# EAGLE design rfm69_32u4_pa (EAGLE 8.3.1)
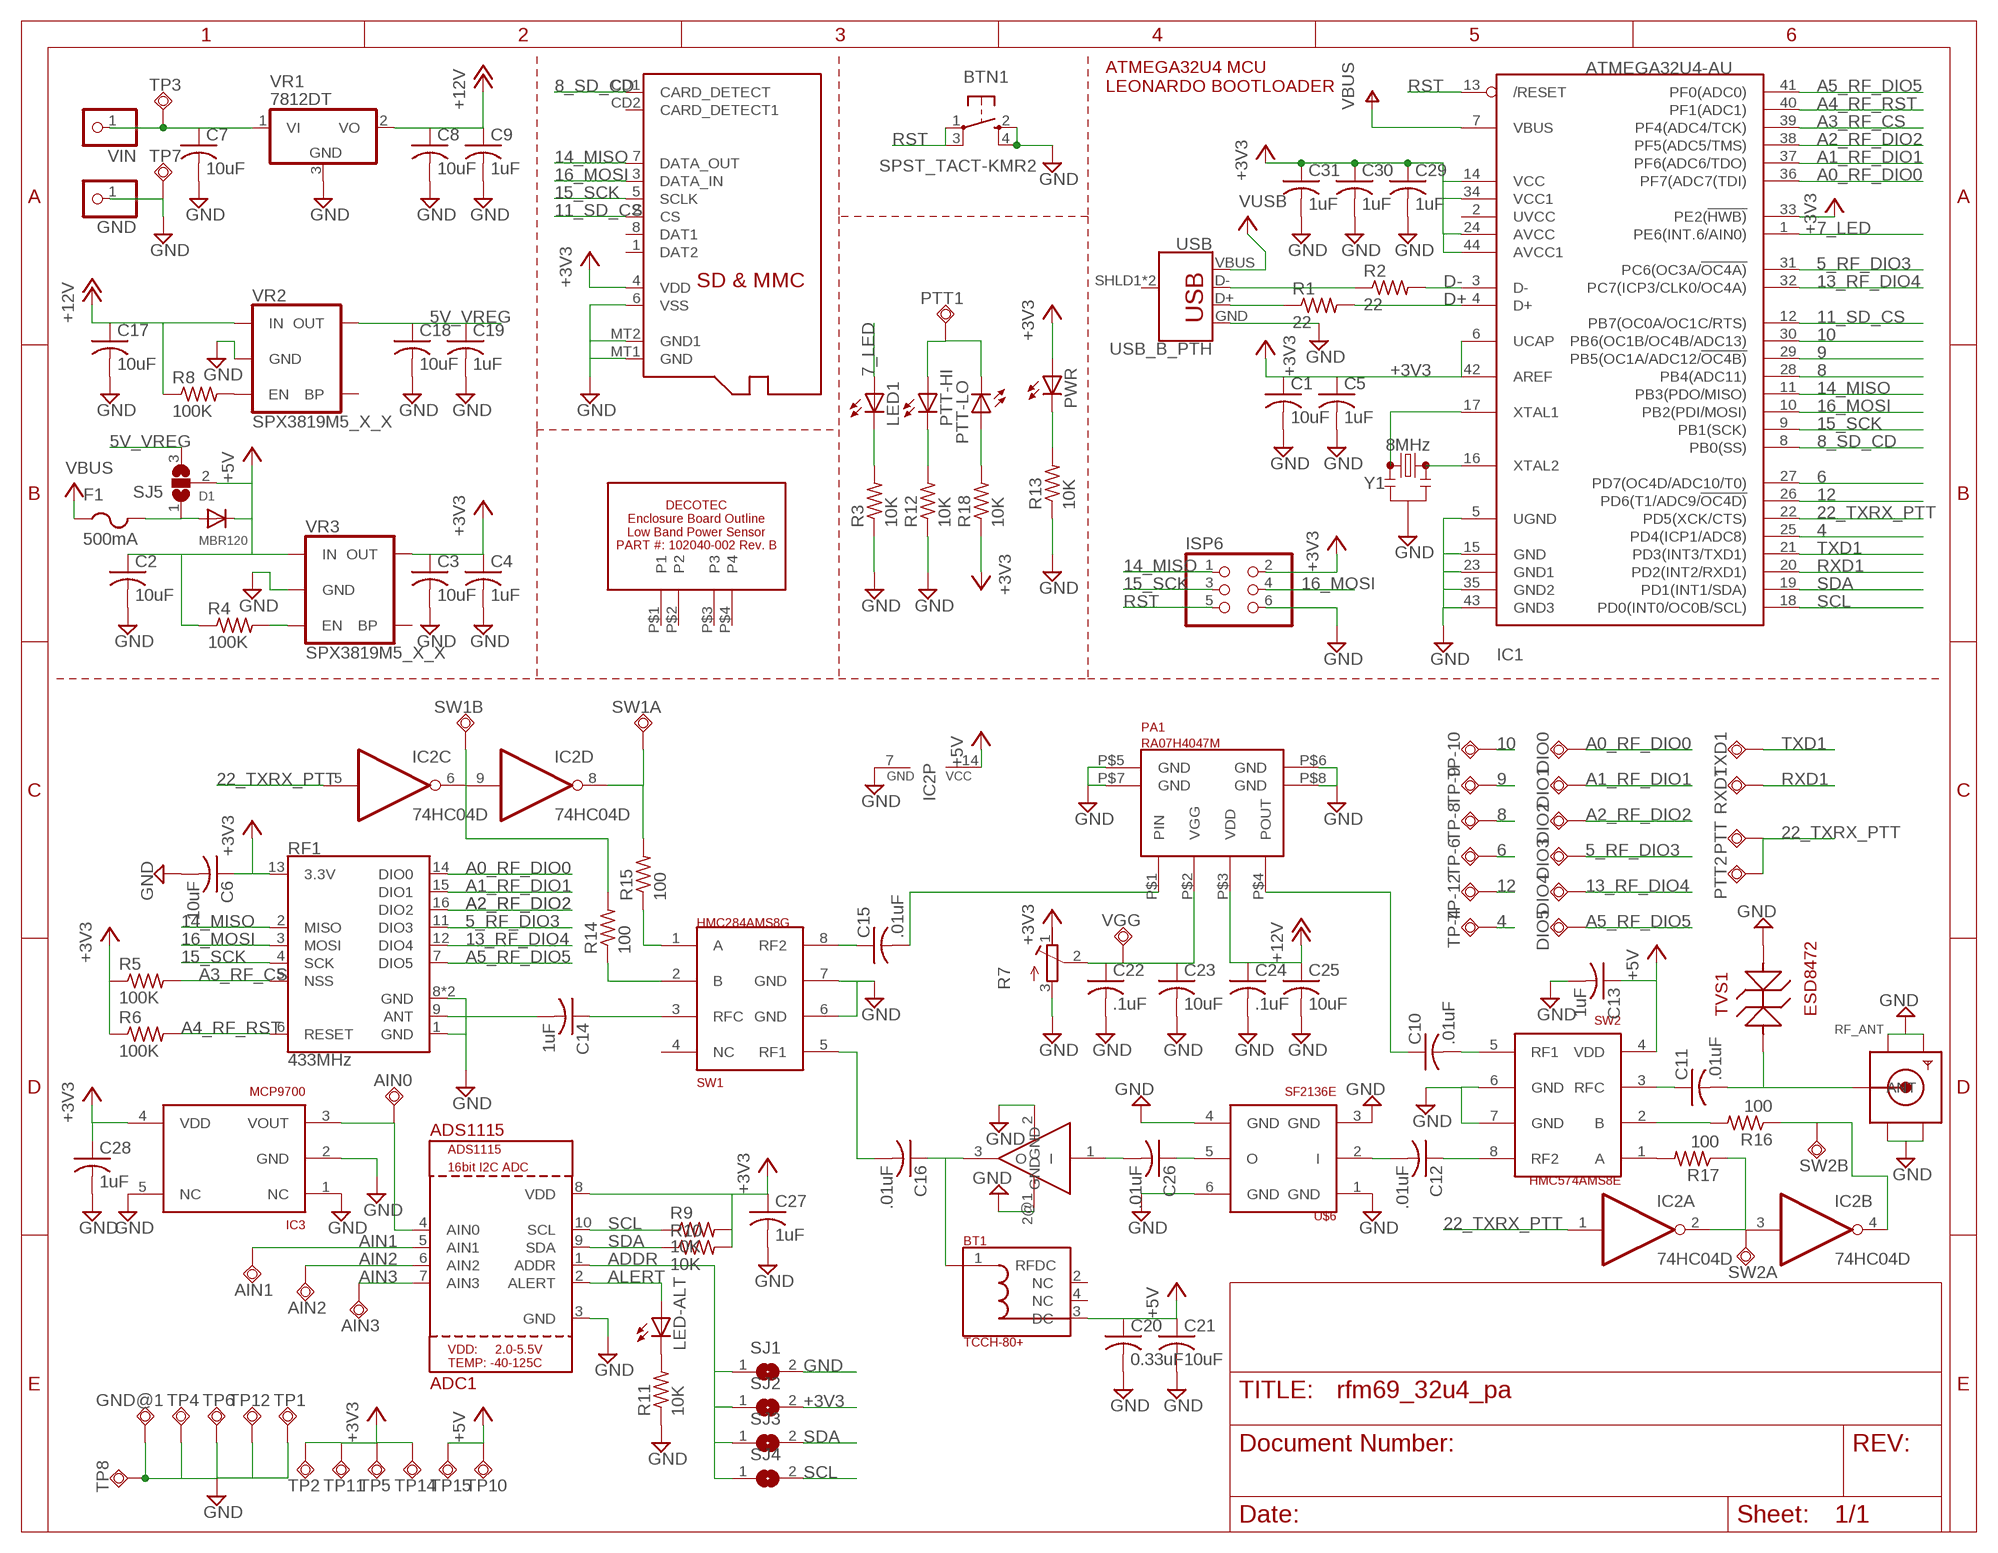
[diagram p0: schematic, sheet 1]

## Parts
ADC1  ADS1115  [MSOP10]
AIN0  TPSQTP10SQ  [TP10SQ]
AIN1  TPSQTP10SQ  [TP10SQ]
AIN2  TPSQTP10SQ  [TP10SQ]
AIN3  TPSQTP10SQ  [TP10SQ]
BT1  TCCH-80+  [TCCH-80+]
BTN1  SPST_TACT-KMR2  [KMR2]
C1  10uF  C-USC0805K  [C0805K]
C2  10uF  C-USC0805K  [C0805K]
C3  10uF  C-USC0805K  [C0805K]
C4  1uF  C-USC0805K  [C0805K]
C5  1uF  C-USC0805K  [C0805K]
C6  10uF  C-USC0805K  [C0805K]
C7  10uF  C-USC0805K  [C0805K]
C8  10uF  C-USC0805K  [C0805K]
C9  1uF  C-USC0805K  [C0805K]
C10  .01uF  C-USC0805K  [C0805K]
C11  .01uF  C-USC0805K  [C0805K]
C12  .01uF  C-USC0805K  [C0805K]
C13  1uF  C-USC0805K  [C0805K]
C14  1uF  C-USC0805K  [C0805K]
C15  .01uF  C-USC0805K  [C0805K]
C16  .01uF  C-USC0805K  [C0805K]
C17  10uF  C-USC0805K  [C0805K]
C18  10uF  C-USC0805K  [C0805K]
C19  1uF  C-USC0805K  [C0805K]
C20  0.33uF  C-USC0805K  [C0805K]
C21  10uF  C-USC0805K  [C0805K]
C22  .1uF  C-USC0805K  [C0805K]
C23  10uF  C-USC0805K  [C0805K]
C24  .1uF  C-USC0805K  [C0805K]
C25  10uF  C-USC0805K  [C0805K]
C26  .01uF  C-USC0805K  [C0805K]
C27  1uF  C-USC0805K  [C0805K]
C28  1uF  C-USC0805K  [C0805K]
C29  1uF  C-USC0805K  [C0805K]
C30  1uF  C-USC0805K  [C0805K]
C31  1uF  C-USC0805K  [C0805K]
D1  MBR120  DIODESOD-123  [SOD-123]
DIO0  TPSQTP10SQ  [TP10SQ]
DIO1  TPSQTP10SQ  [TP10SQ]
DIO2  TPSQTP10SQ  [TP10SQ]
DIO3  TPSQTP10SQ  [TP10SQ]
DIO4  TPSQTP10SQ  [TP10SQ]
DIO5  TPSQTP10SQ  [TP10SQ]
F1  500mA  PTCFUSE-1206  [R1206]
GND  PINHD-1X1  [1X01]
GND@1  TPSQTP10SQ  [TP10SQ]
IC1  ATMEGA32U4-AU  [TQFP44]
IC2  74HC04D  [SO14]
IC3  MCP9700  [SC70]
ISP6  PINHD-2X3  [2X03]
LED1  LEDCHIPLED_0805  [CHIPLED_0805]
LED-ALT  LEDCHIPLED_0805  [CHIPLED_0805]
PA1  RA07H4047M  [H46]
PGA-103+  PGA-103+  [SOT89]
PTT  TPSQTP10SQ  [TP10SQ]
PTT1  TPSQTP10SQ  [TP10SQ]
PTT2  TPSQTP10SQ  [TP10SQ]
PTT-HI  LEDCHIPLED_0805  [CHIPLED_0805]
PTT-LO  LEDCHIPLED_0805  [CHIPLED_0805]
PWR  LEDCHIPLED_0805  [CHIPLED_0805]
R1  22  R-US_R0805  [R0805]
R2  22  R-US_R0805  [R0805]
R3  10K  R-US_R0805  [R0805]
R4  100K  R-US_R0805  [R0805]
R5  100K  R-US_R0805  [R0805]
R6  100K  R-US_R0805  [R0805]
R7  R-TRIMM3314G  [RTRIM3314G]
R8  100K  R-US_R0805  [R0805]
R9  10K  R-US_R0805  [R0805]
R10  10K  R-US_R0805  [R0805]
R11  10K  R-US_R0805  [R0805]
R12  10K  R-US_R0805  [R0805]
R13  10K  R-US_R0805  [R0805]
R14  100  R-US_R0805  [R0805]
R15  100  R-US_R0805  [R0805]
R16  100  R-US_R0805  [R0805]
R17  100  R-US_R0805  [R0805]
R18  10K  R-US_R0805  [R0805]
RF1  433MHz  RFM69HCW-433  [RFM69HCW-XXXS2]
RF_ANT  SMACONNECTOR_EDGE  [SMA_EDGELAUNCH]
RXD1  TPSQTP10SQ  [TP10SQ]
SJ1  SJ  [SJ]
SJ2  SJ  [SJ]
SJ3  SJ  [SJ]
SJ4  SJ  [SJ]
SJ5  SJ2W  [SJ_2]
SW1  HMC284AMS8G  [MSOP8]
SW1A  TPSQTP10SQ  [TP10SQ]
SW1B  TPSQTP10SQ  [TP10SQ]
SW2  HMC574AMS8E  [MSOP8]
SW2A  TPSQTP10SQ  [TP10SQ]
SW2B  TPSQTP10SQ  [TP10SQ]
TP1  TPSQTP10SQ  [TP10SQ]
TP2  TPSQTP10SQ  [TP10SQ]
TP3  TPSQTP20SQ  [TP20SQ]
TP4  TPSQTP10SQ  [TP10SQ]
TP5  TPSQTP10SQ  [TP10SQ]
TP6  TPSQTP10SQ  [TP10SQ]
TP7  TPSQTP20SQ  [TP20SQ]
TP8  TPSQTP10SQ  [TP10SQ]
TP10  TPSQTP10SQ  [TP10SQ]
TP11  TPSQTP10SQ  [TP10SQ]
TP12  TPSQTP10SQ  [TP10SQ]
TP14  TPSQTP10SQ  [TP10SQ]
TP15  TPSQTP10SQ  [TP10SQ]
TP-4  TPSQTP10SQ  [TP10SQ]
TP-6  TPSQTP10SQ  [TP10SQ]
TP-8  TPSQTP10SQ  [TP10SQ]
TP-9  TPSQTP10SQ  [TP10SQ]
TP-10  TPSQTP10SQ  [TP10SQ]
TP-12  TPSQTP10SQ  [TP10SQ]
TVS1  ESD8472  [X3DFN2]
TXD1  TPSQTP10SQ  [TP10SQ]
U$2  DECOTEC_102040-002B  [DECOTEC_102040-002B]
U$3  MICROSD  [MICROSD]
U$6  SF2136E  [SM3030-6]
USB  USB_B_PTH  [USB-B-PTH]
VGG  TPSQTP10SQ  [TP10SQ]
VIN  PINHD-1X1  [1X01]
VR1  7812DT  [TO252]
VR2  SPX3819M5_X_X  V_REG_SPX3819-SOT23-5  [SOT23-5]
VR3  SPX3819M5_X_X  V_REG_SPX3819-SOT23-5  [SOT23-5]
Y1  8MHz  RESONATOR-8MHZSMD_3.2X1.3  [RESONATOR-SMD-3.2X1.3]

## Nets
4: IC1.25(PD4(ICP1/ADC8)) TP-4.TP
5_RF_DIO3: DIO3.TP IC1.31(PC6(OC3A/!OC4A)) RF1.11(DIO3)
5V_VREG: C18.1 C19.1 SJ5.3 VR2.5(OUT)
6: IC1.27(PD7(OC4D/ADC10/T0)) TP-6.TP
7_LED: IC1.1(PE6(INT.6/AIN0)) LED1.A
8: IC1.28(PB4(ADC11)) TP-8.TP
8_SD_CD: IC1.8(PB0(SS)) U$3.CD1(CARD_DETECT)
9: IC1.29(PB5(OC1A/ADC12/!OC4B)) TP-9.TP
10: IC1.30(PB6(OC1B/OC4B/ADC13)) TP-10.TP
11_SD_CS: IC1.12(PB7(OC0A/OC1C/RTS)) U$3.2(CS)
12: IC1.26(PD6(T1/ADC9/!OC4D)) TP-12.TP
13_RF_DIO4: DIO4.TP IC1.32(PC7(ICP3/CLK0/OC4A)) RF1.12(DIO4)
14_MISO: IC1.11(PB3(PDO/MISO)) ISP6.1 RF1.2(MISO) U$3.7(DATA_OUT)
15_SCK: IC1.9(PB1(SCK)) ISP6.3 RF1.4(SCK) U$3.5(SCLK)
16_MOSI: IC1.10(PB2(PDI/MOSI)) ISP6.4 RF1.3(MOSI) U$3.3(DATA_IN)
22_TXRX_PTT: IC1.22(PD5(XCK/CTS)) IC2.1(A:I) IC2.5(C:I) PTT2.TP PTT.TP
+3V3: ADC1.8(VDD) C1.1 C3.1 C4.1 C5.1 C6.1 C27.1 C28.1 C29.1 C30.1 C31.1 IC1.6(UCAP) IC1.14(VCC) IC1.24(AVCC) IC1.33(PE2(!HWB)) IC1.34(VCC1) IC1.42(AREF) IC1.44(AVCC1) IC3.4(VDD) ISP6.2 PWR.A R5.1 R6.1 R7.1(E) R9.2 R10.2 R18.1 RF1.13(3.3V) SJ2.2 TP2.TP TP5.TP TP11.TP TP14.TP U$3.4(VDD) VR3.5(OUT)
+5V: BT1.3(DC) C2.1 C13.1 C20.1 C21.1 D1.C IC2.14(P:VCC) R4.1 SJ5.2 SW2.4(VDD) TP10.TP TP15.TP VR3.1(IN)
+12V: C8.1 C9.1 C17.1 C24.1 C25.1 PA1.P$3(VDD) R8.1 VR1.2(VO) VR2.1(IN)
A0_RF_DIO0: DIO0.TP IC1.36(PF7(ADC7(TDI)) RF1.14(DIO0)
A1_RF_DIO1: DIO1.TP IC1.37(PF6(ADC6/TDO)) RF1.15(DIO1)
A2_RF_DIO2: DIO2.TP IC1.38(PF5(ADC5/TMS)) RF1.16(DIO2)
A3_RF_CS: IC1.39(PF4(ADC4/TCK)) R5.2 RF1.5(NSS)
A4_RF_RST: IC1.40(PF1(ADC1)) R6.2 RF1.6(RESET)
A5_RF_DIO5: DIO5.TP IC1.41(PF0(ADC0)) RF1.7(DIO5)
ADDR: ADC1.1(ADDR) SJ1.1 SJ2.1 SJ3.1 SJ4.1
AIN1: ADC1.5(AIN1) AIN1.TP
AIN2: ADC1.6(AIN2) AIN2.TP
AIN3: ADC1.7(AIN3) AIN3.TP
ALERT: ADC1.2(ALERT) LED-ALT.A
ANT: C14.2 RF1.9(ANT)
D+: IC1.4(D+) R1.2
D-: IC1.3(D-) R2.2
EN: R4.2 VR3.3(EN)
GND: ADC1.3(GND) BTN1.2(S) BTN1.4(S1) C1.2 C2.2 C3.2 C4.2 C5.2 C6.2 C7.2 C8.2 C9.2 C13.2 C17.2 C18.2 C19.2 C20.2 C21.2 C22.2 C23.2 C24.2 C25.2 C27.2 C28.2 C29.2 C30.2 C31.2 GND.1 GND@1.TP IC1.5(UGND) IC1.15(GND) IC1.23(GND1) IC1.35(GND2) IC1.43(GND3) IC2.7(P:GND) IC3.1(NC) IC3.2(GND) IC3.5(NC) ISP6.6 PA1.P$5(GND) PA1.P$6(GND) PA1.P$7(GND) PA1.P$8(GND) PGA-103+.2(GND) PGA-103+.2@1(GND) R3.1 R7.3(A) R11.1 R12.1 R13.1 RF1.1(GND) RF1.8(GND) RF1.10(GND) RF_ANT.GND@1(GND4) RF_ANT.GND@2(GND3) RF_ANT.GND@3(GND2) RF_ANT.GND@4(GND1) SJ1.2 SW1.6(GND) SW1.7(GND) SW2.6(GND) SW2.7(GND) TP1.TP TP4.TP TP6.TP TP7.TP TP8.TP TP12.TP TVS1.P$2 U$3.6(VSS) U$3.MT1(GND) U$3.MT2(GND1) U$6.1(GND) U$6.3(GND) U$6.4(GND) U$6.6(GND) USB.GND VR1.3(GND) VR2.2(GND) VR3.2(GND) Y1.2
N$1: R1.1 USB.D+
N$2: LED1.C R3.2
N$3: R2.1 USB.D-
N$4: C15.2 PA1.P$1(PIN)
N$5: PTT1.TP PTT-HI.A PTT-LO.C
N$6: C10.1 PA1.P$4(POUT)
N$7: C10.2 SW2.5(RF1)
N$8: PTT-HI.C R12.2
N$9: PWR.C R13.2
N$10: C26.1 U$6.5(O)
N$11: C11.2 RF_ANT.P(ANT) TVS1.P$1
N$12: C11.1 SW2.3(RFC)
N$13: C14.1 SW1.3(RFC)
N$14: C15.1 SW1.8(RF2)
N$15: C16.2 SW1.5(RF1)
N$16: R14.1 SW1.2(B)
N$17: BT1.1(RFDC) C16.1 PGA-103+.3(O)
N$18: C22.1 C23.1 PA1.P$2(VGG) R7.2(S) VGG.TP
N$19: C12.1 SW2.8(RF2)
N$20: C12.2 U$6.2(I)
N$21: R15.1 SW1.1(A)
N$22: C26.2 PGA-103+.1(I)
N$23: R8.2 VR2.3(EN)
N$24: LED-ALT.C R11.2
N$25: R17.2 SW2.1(A)
N$26: R16.2 SW2.2(B)
N$27: PTT-LO.A R18.2
RST: BTN1.1(P) BTN1.3(P1) IC1.13(/RESET) ISP6.5
RXD1: IC1.20(PD2(INT2/RXD1)) RXD1.TP
SCL: ADC1.10(SCL) IC1.18(PD0(INT0/OC0B/SCL)) R9.1 SJ4.2
SDA: ADC1.9(SDA) IC1.19(PD1(INT1/SDA)) R10.1 SJ3.2
SW1A: IC2.8(D:O) R15.2 SW1A.TP
SW1B: IC2.6(C:O) IC2.9(D:I) R14.2 SW1B.TP
SW2A: IC2.2(A:O) IC2.3(B:I) R17.1 SW2A.TP
SW2B: IC2.4(B:O) R16.1 SW2B.TP
TXD1: IC1.21(PD3(INT3/TXD1)) TXD1.TP
V_PA_TEMP: ADC1.4(AIN0) AIN0.TP IC3.3(VOUT)
VBUS: D1.A F1.2 IC1.7(VBUS) SJ5.1
VIN: C7.1 TP3.TP VIN.1 VR1.1(VI)
VUSB: F1.1 USB.VBUS ; supply symbol labelled VBUS
XTAL1: IC1.17(XTAL1) Y1.1
XTAL2: IC1.16(XTAL2) Y1.3
Unconnected: BT1.2(NC) BT1.4(NC) IC1.2(UVCC) IC2.10(E:O) IC2.11(E:I) IC2.12(F:O) IC2.13(F:I) SW1.4(NC) U$2.P$1(P1) U$2.P$2(P2) U$2.P$3(P3) U$2.P$4(P4) U$3.1(DAT2) U$3.8(DAT1) U$3.CD2(CARD_DETECT1) USB.SHLD1(SHIELD) USB.SHLD2(SHIELD) VR2.4(BP) VR3.4(BP)

## Notes on the sheet
- ATMEGA32U4 MCU
  LEONARDO BOOTLOADER

## Library data of the parts
ADC1 = vtgs:ADS1115
AIN0 AIN1-AIN3 DIO0 DIO1-DIO5 GND@1 PTT PTT1 PTT2 RXD1 SW1A SW1B SW2A SW2B TP1-TP8 TP10-TP12 TP14 TP15 TP-4 TP-6 TP-8-TP-10 TP-12 TXD1 VGG = testpad:TPSQ: Test pad
BT1 = kj4qlp:TCCH-80+
BTN1 = adafruit:SPST_TACT: SMT 6mm switch, EVQQ2 series http://www.ladyada.net/library/eagle
C1-C31 = rcl:C-US: CAPACITOR, American symbol
D1 = adafruit:DIODE: Diode SMADIODE - SMA Surface Mount Package 20V 1A Schottky Diode Digikey: 641-1014-6-ND DO-1N4148 - Through Hole Small Current Diode SOD-123 20V 1 A (.5mV Vf) Schottky Diode - Digikey: MBRX120TPMSCT-ND SOD-323 10V 570mA (.38mV Vf, 3ns) Schottky Diode - Digikey: ZLLS410CT-ND SOD-523 30V 30mA Schottky Diode (RB751S-40TE61) - Digikey: RB751S-40TE61CT-ND SOT23-R/W - SOT23 Package (R = Solder Paste/Reflow Ovens, W = Hand-Soldering) BAT54Film 40V 300mA - Digikey: 497-7162-1-ND
F1 = adafruit:PTCFUSE: PTC fuses, resettable thermistors
GND VIN = pinhead:PINHD-1X1: PIN HEADER
IC1 = adafruit:ATMEGA32U4: http://www.ladyada.net/library/eagle
IC2 = 74xx-eu:74*04: Hex INVERTER
IC3 = vtgs:MCP9700
ISP6 = pinhead:PINHD-2X3: PIN HEADER
LED1 LED-ALT PTT-HI PTT-LO PWR = adafruit:LED: LED OSRAM: - CHIPLED LG R971, LG N971, LY N971, LG Q971, LY Q971, LO R971, LY R971 LH N974, LH R974 LS Q976, LO Q976, LY Q976 LO Q996 - Hyper CHIPLED LW Q18S LB Q993, LB Q99A, LB R99A - SideLED LS A670, LO A670, LY A670, LG A670, LP A670 LB A673, LV A673, LT A673, LW A673 LH A674 LY A675 LS A676, LA A676, LO A676, LY A676, LW A676 LS A679, LY A679, LG A679 - Hyper Micro SIDELED® LS Y876, LA Y876, LO Y876, LY Y876 LT Y87S - SmartLED LW L88C, LW L88S LB L89C, LB L89S, LG L890 LS L89K, LO L89K, LY L89K LS L896, LA L896, LO L896, LY L896 - TOPLED LS T670, LO T670, LY T670, LG T670, LP T670 LSG T670, LSP T670, LSY T670, LOP T670, LYG T670 LG T671, LOG T671, LSG T671 LB T673, LV T673, LT T673, LW T673 LH T674 LS T676, LA T676, LO T676, LY T676, LB T676, LH T676, LSB T676, LW T676 LB T67C, LV T67C, LT T67C, LS T67K, LO T67K, LY T67K, LW E67C LS E67B, LA E67B, LO E67B, LY E67B, LB E67C, LV E67C, LT E67C LW T67C LS T679, LY T679, LG T679 LS T770, LO T770, LY T770, LG T770, LP T770 LB T773, LV T773, LT T773, LW T773 LH T774 LS E675, LA E675, LY E675, LS T675 LS T776, LA T776, LO T776, LY T776, LB T776 LHGB T686 LT T68C, LB T68C - Hyper Mini TOPLED® LB M676 - Mini TOPLED Santana® LG M470 LS M47K, LO M47K, LY M47K Source: http://www.osram.convergy.de/
PA1 = kj4qlp:RA07H4047M
PGA-103+ = kj4qlp:PGA-103+
R1-R6 R8-R18 = adafruit:R-US_: RESISTOR, American symbol
R7 = rcl:R-TRIMM: Trimm resistor
RF1 = SparkFun-RF:RFM69H: Hope RF RFM69H ISM Transceiver Module The RFM69H is a transceiver module capable of operation over a wide frequency range, including the 315,433,868 and 915MHz license-free ISM (Industry Scientific and Medical) frequency bands. All major RF communication parameters are programmable and most of them can be dynamically set. The RFM69H offers the unique advantage of programmable narrow-band and wide- band communication modes. The RFM69H is optimized for low power consumption while offering high RF output power and channelized operation.Compliance ETSI and FCC regulations. Datasheet <http://www.hoperf.cn/upload/docs/RF/SX/RFM69H_DataSheet_v1.3.pdf> SparkFun Products RFM69HCW Wireless Transceiver - 915MHz <https://www.sparkfun.com/products/13909> (COM-13909) RFM69HCW Wireless Transceiver - 434MHz <https://www.sparkfun.com/products/13910> (COM-13910) SparkFun RFM69 Breakout (915MHz) <https://www.sparkfun.com/products/12775> (WRL-12775) SparkFun RFM69 Breakout (434MHz) <https://www.sparkfun.com/products/12823> (WRL-12823); PROD_ID: IC-12053
RF_ANT = adafruit:SMACONNECTOR: SMA Connector 90° DIP SMA Connector, 50 Ohm (4UConnector: 07259)
SJ1-SJ4 = jumper:SJ: SMD solder JUMPER
SJ5 = jumper:SJ2W: SMD solder JUMPER
SW1 = kj4qlp:HMC284AMS8G
SW2 = kj4qlp:HMC574AMS8E
TVS1 = kj4qlp:ESD8472
U$2 = vtgs:DECOTEC_102040-002B
U$3 = adafruit:MICROSD: Micro-SD / Transflash card holder with SPI pinout For the 3M # 2908-05WB-MG and/or 4UCON #19656 push-push type
U$6 = kj4qlp:SF2136E
USB = SparkFun-Connectors:USB_B: USB Type B Connector SparkFun Products: SparkFun Stepoko <https://www.sparkfun.com/products/13899> PTH; PROD_ID: CONN-08278; SF_ID: PRT-00139
VR1 = adafruit:78*: Positive VOLTAGE REGULATOR Added bigger pads to the TO-92 package
VR2 VR3 = kj4qlp:V_REG_SPX3819: SPX3819 Voltage Regulator 3.3V 500mA, 16V input Datasheet <https://www.exar.com/content/document.ashx?id=22106> SparkFun Products: SparkFun Serial Controlled Motor Driver <https://www.sparkfun.com/products/13911>; PROD_ID: VREG-13321
Y1 = SparkFun-Clocks:RESONATOR-8MHZ: 8MHz Resonator Digikey Example <http://www.digikey.com/product-detail/en/murata-electronics-north-america/CSTCE10M0G55-R0/490-1196-1-ND/584633> Frequency: 8MHz Frequency Stability: ±0.2% Frequency Tolerance: ±0.5% Capacitance: 33pF SparkFun Products Arduino Pro Mini 328- 3.3V/8MHz <https://www.sparkfun.com/products/11114> SparkFun Digital Sandbox <https://www.sparkfun.com/products/12651>; PROD_ID: XTAL-08895

## Board
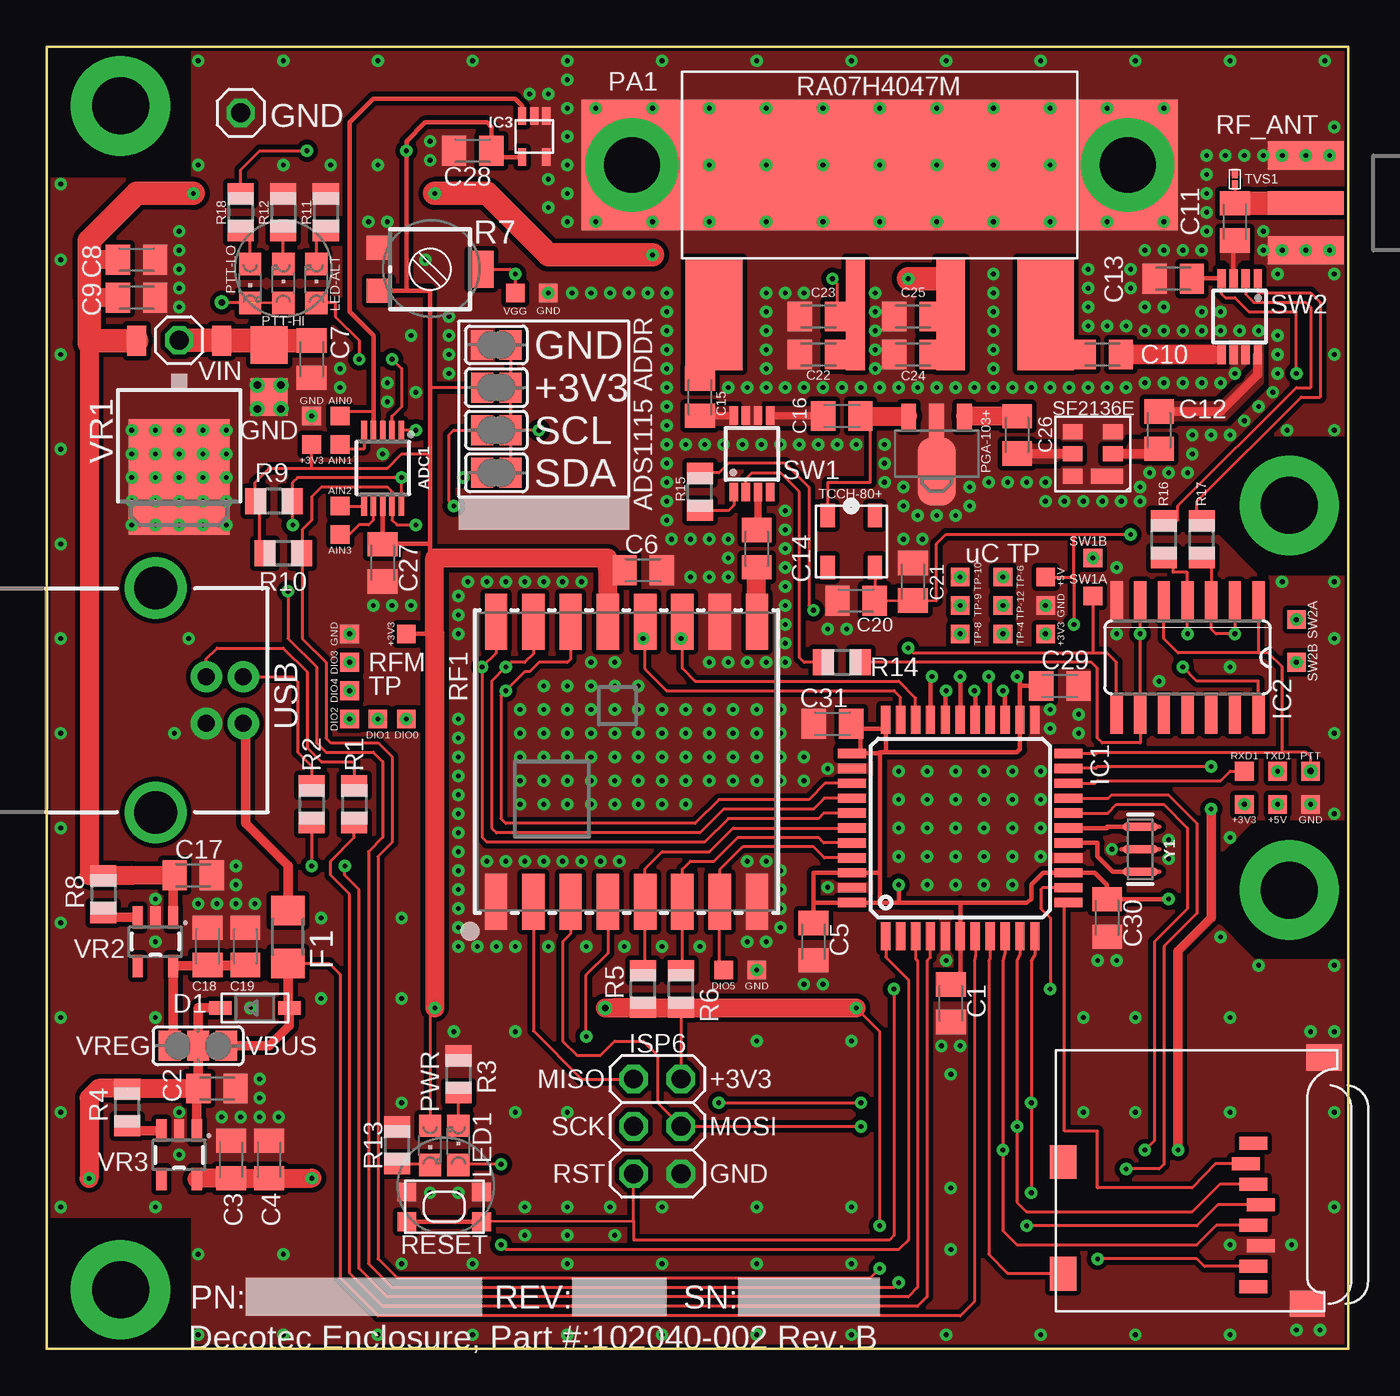
[diagram p1: board, top side]
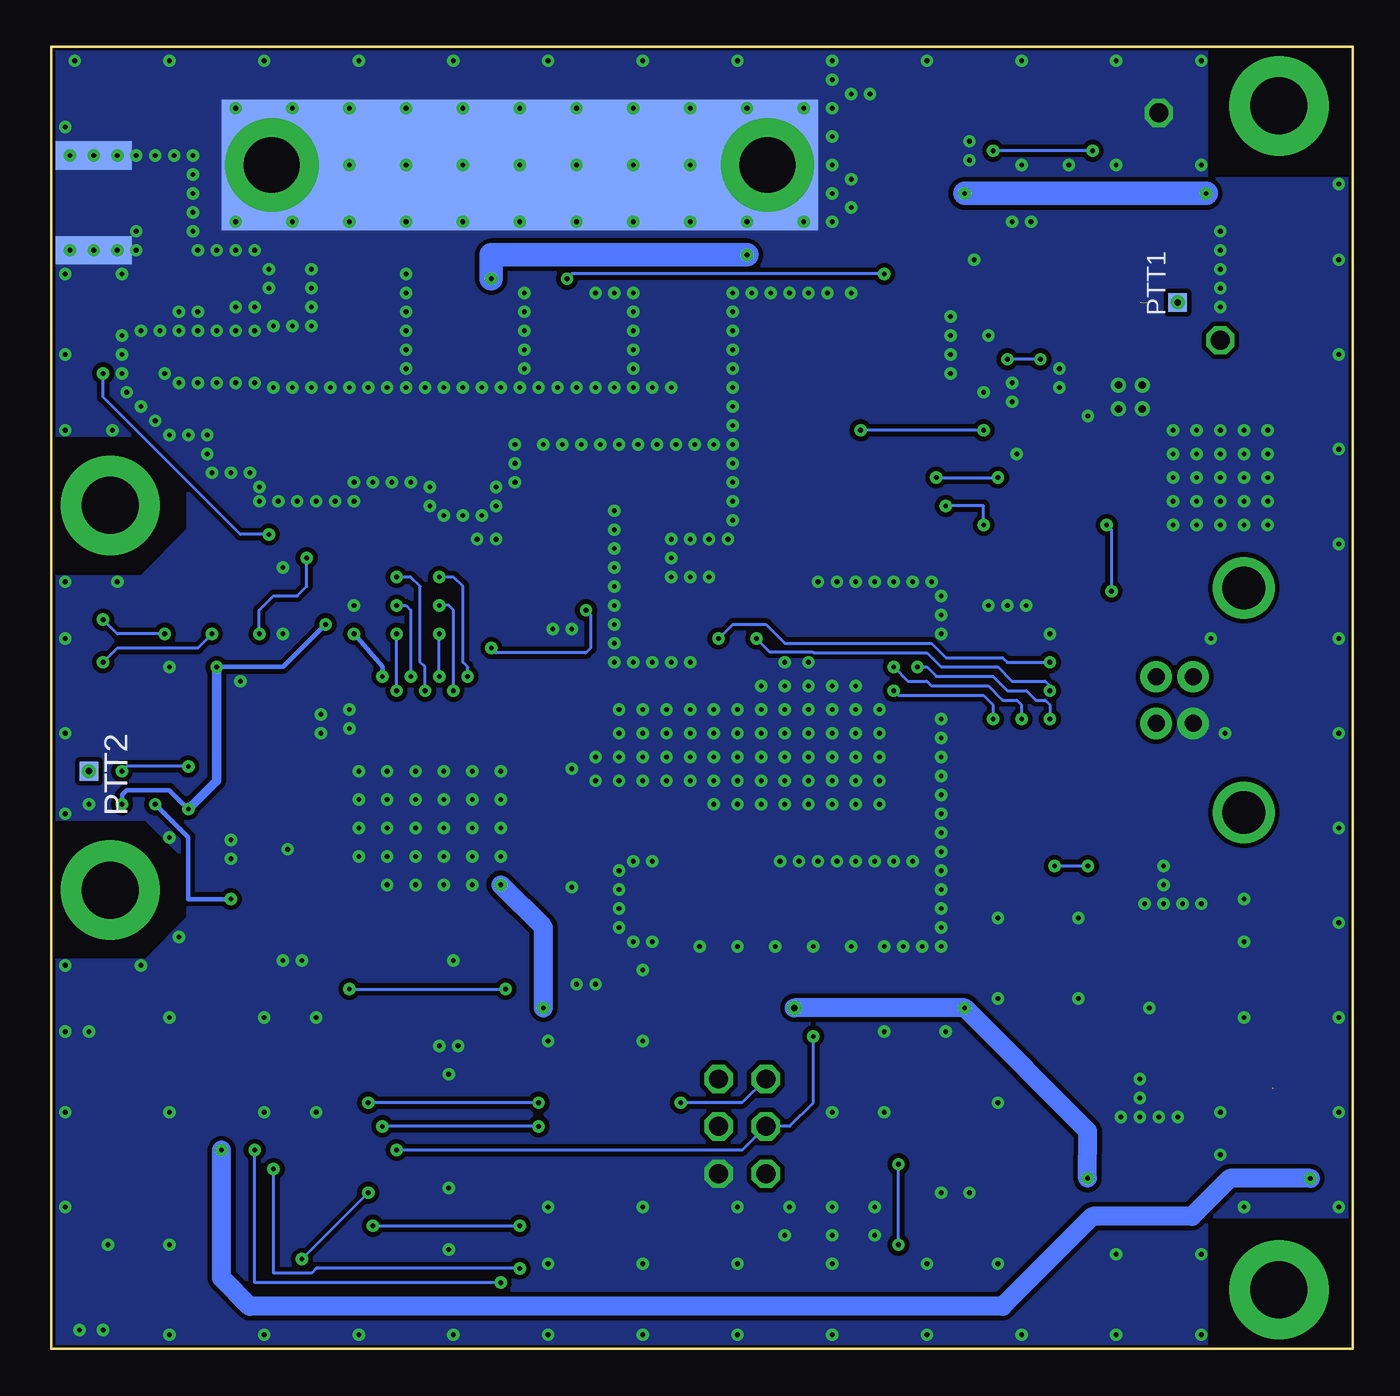
[diagram p2: board, bottom side, seen from below]

Size 69.85 x 69.85 mm. Coordinates in mm from the lower left corner, seen from the top.
Copper layers (1*16): Top 0.035mm / dielectric 1.5mm / Bottom 0.035mm
Design rules "default *": minimum track width 6mil, minimum drill 10mil, track to track 10mil, track to pad 6mil, pad to pad 6mil, via to via 6mil, smd to smd 6mil, copper to edge 6mil, drill to drill 6mil, minimum pad ring 10mil, minimum via ring 8mil, stop-mask expansion 4mil, vias tented up to drill 0mil, thermal gap 10mil

### Footprints (pad centres in the part's own frame; a part is rotated, then mirrored left to right if it is on the bottom)
MSOP10 = smd 0.3 x 1: 1 -1,-2.05; 2 -0.5,-2.05; 3 0,-2.05; 4 0.5,-2.05; 5 1,-2.05; 6 1,2.05; 7 0.5,2.05; 8 0,2.05; 9 -0.5,2.05; 10 -1,2.05
TP10SQ = smd 1 x 1: TP 0,0
TCCH-80+ = smd 0.762 x 1.27: 1 -1.27,1.397; 2 -1.27,-1.397; 3 1.27,-1.397; 4 1.27,1.397
KMR2 = smd 1 x 1: 1 2,0.8; 2 2,-0.8; 3 -2,0.8; 4 -2,-0.8
C0805K = smd 1.3 x 1.6: 1 -1,0; 2 1,0
SOD-123 = smd 1.2 x 0.7: A 1.85,0; C -1.85,0
R1206 = smd 1.6 x 1.803: 1 -1.422,0; 2 1.422,0
1X01 = drill 1.016 octagon: 1 0,0
TQFP44 = smd 1.5 x 0.5: 1 -5.8,4; 2 -5.8,3.2; 3 -5.8,2.4; 4 -5.8,1.6; 5 -5.8,0.8; 6 -5.8,0; 7 -5.8,-0.8; 8 -5.8,-1.6; 9 -5.8,-2.4; 10 -5.8,-3.2; 11 -5.8,-4; 23 5.8,-4; 24 5.8,-3.2; 25 5.8,-2.4; 26 5.8,-1.6; 27 5.8,-0.8; 28 5.8,0; 29 5.8,0.8; 30 5.8,1.6; 31 5.8,2.4; 32 5.8,3.2; 33 5.8,4 | smd 0.5 x 1.5: 12 -4,-5.8; 13 -3.2,-5.8; 14 -2.4,-5.8; 15 -1.6,-5.8; 16 -0.8,-5.8; 17 0,-5.8; 18 0.8,-5.8; 19 1.6,-5.8; 20 2.4,-5.8; 21 3.2,-5.8; 22 4,-5.8; 34 4,5.8; 35 3.2,5.8; 36 2.4,5.8; 37 1.6,5.8; 38 0.8,5.8; 39 0,5.8; 40 -0.8,5.8; 41 -1.6,5.8; 42 -2.4,5.8; 43 -3.2,5.8; 44 -4,5.8
SO14 = smd 0.66 x 2.032: 1 -3.81,-3.073; 2 -2.54,-3.073; 3 -1.27,-3.073; 4 0,-3.073; 5 1.27,-3.073; 6 2.54,-3.073; 7 3.81,-3.073; 8 3.81,3.073; 9 2.54,3.073; 10 1.27,3.073; 11 0,3.073; 12 -1.27,3.073; 13 -2.54,3.073; 14 -3.81,3.073
SC70 = smd 0.45 x 0.95: 1 0.65,1.1; 2 0,1.1; 3 -0.65,1.1; 4 -0.65,-1.1; 5 0.65,-1.1
2X03 = drill 1.016 octagon: 1 -2.54,-1.27; 2 -2.54,1.27; 3 0,-1.27; 4 0,1.27; 5 2.54,-1.27; 6 2.54,1.27
CHIPLED_0805 = smd 1.2 x 1.2: A 0,-1.05; C 0,1.05
H46 = smd 3.048 x 6: P$1 -8.9,-8; P$4 8.9,-8 | smd 1.016 x 6: P$2 -1.3,-8 | smd 1.524 x 6: P$3 3.8,-8 | smd 32 x 7: P$5 0,0 | smd 32 x 7 bottom: P$6 0,0 | drill 3 pad 5: P$7 -13.3,0; P$8 13.3,0
SOT89 = smd 0.8 x 1.4: 1 -1.499,-1.981; 3 1.499,-1.981 | smd 0.8 x 1.9: 2 0,-1.727 | smd 2.032 x 3.65: 2@1 0,0.94
R0805 = smd 1.1 x 1.4: 1 -1,0; 2 1,0
RTRIM3314G = smd 1.3 x 1.3: 1 1.15,-2.75; 3 -1.15,-2.75 | smd 2 x 1.3: 2 0,2.75
RFM69HCW-XXXS2 = smd 3 x 1.2: 1 -7.5,7; 2 -7.5,5; 3 -7.5,3; 4 -7.5,1; 5 -7.5,-1; 6 -7.5,-3; 7 -7.5,-5; 8 -7.5,-7; 9 7.5,-7; 10 7.5,-5; 11 7.5,-3; 12 7.5,-1; 13 7.5,1; 14 7.5,3; 15 7.5,5; 16 7.5,7
SMA_EDGELAUNCH = smd 4.064 x 1.524: GND@1 2.032,-2.54; GND@2 2.032,2.54 | smd 4.064 x 1.524 bottom: GND@3 2.032,2.54; GND@4 2.032,-2.54 | smd 4.064 x 1.27: P 2.032,0
SJ = smd 1.168 x 1.6: 1 -0.762,0; 2 0.762,0
SJ_2 = smd 1.168 x 1.6: 1 -1.524,0; 2 0,0; 3 1.524,0
MSOP8 = smd 0.45 x 1: 1 -0.975,-2.05; 2 -0.325,-2.05; 3 0.325,-2.05; 4 0.975,-2.05; 5 0.975,2.05; 6 0.325,2.05; 7 -0.325,2.05; 8 -0.975,2.05
TP20SQ = smd 2 x 2: TP 0,0
X3DFN2 = smd 0.5 x 0.3: P$1 -0.315,0; P$2 0.315,0
DECOTEC_102040-002B = drill 3.048 pad 5.334: P$1 3.969,3.175; P$2 3.969,66.675; P$3 66.675,45.244; P$4 66.675,24.606
MICROSD = smd 0.7 x 1.5: 1 9,-10.64; 2 7.9,-10.24; 3 6.8,-10.64; 4 5.7,-11.04; 5 4.6,-10.64; 6 3.5,-11.04; 7 2.4,-10.64; 8 1.3,-10.64 | smd 1.8 x 1.4: CD1 2,-0.44; CD2 8,-0.44 | smd 1.4 x 1.9: MT1 0.4,-13.54; MT2 13.6,-14.44
SM3030-6 = smd 1.7 x 0.81: 1 -0.75,1.195 | smd 1.05 x 0.81: 2 -1.075,0; 3 -1.075,-1.195; 4 1.075,-1.195; 5 1.075,0; 6 1.075,1.195
USB-B-PTH = drill 0.914 pad 1.676: D+ 4,1.25; D- 5.981,1.25; GND 4,-1.25; VBUS 5.981,-1.25 | drill 2.286: SHLD1 1.282,-6.02; SHLD2 1.282,6.02
TO252 = smd 1 x 1.6: 1 -2.28,-4.8; 2 2.28,-4.8 | smd 5.4 x 6.2: 3 0,2.5
SOT23-5 = smd 0.55 x 1.2: 1 -0.95,-1.3; 2 0,-1.3; 3 0.95,-1.3; 4 0.95,1.3; 5 -0.95,1.3
RESONATOR-SMD-3.2X1.3 = smd 0.45 x 1.905: 1 -1.2,0; 2 0,0; 3 1.2,0

### Placement (x,y rotation side)
ADC1  18.03,47.24 180 top
AIN0  15.75,50.04 0 top
AIN1  15.75,48.51 0 top
AIN2  15.75,45.21 0 top
AIN3  15.75,43.69 0 top
BT1  43.18,43.31 0 top
BTN1  21.34,7.62 180 top
C1  48.51,18.54 270 top
C2  9.14,13.97 0 top
C3  9.91,10.16 90 top
C4  11.94,10.16 90 top
C5  41.15,21.84 270 top
C6  32,41.77 0 top
C7  14.22,53.09 270 top
C8  4.83,58.42 0 top
C9  4.83,56.39 0 top
C10  56.64,53.34 0 top
C11  63.75,60.45 90 top
C12  59.69,49.28 270 top
C13  60.45,57.4 180 top
C14  38.1,42.93 270 top
C15  35.05,51.05 90 top
C16  42.67,50.04 180 top
C17  7.87,25.4 0 top
C18  8.64,21.59 90 top
C19  10.67,21.59 90 top
C20  43.43,40.13 180 top
C21  46.48,41.15 90 top
C22  41.4,53.34 180 top
C23  41.4,55.37 180 top
C24  46.48,53.34 180 top
C25  46.48,55.37 180 top
C26  52.07,49.02 90 top
C27  18.03,42.16 270 top
C28  22.86,64.26 180 top
C29  54.36,35.56 0 top
C30  56.9,23.11 270 top
C31  42.16,33.53 180 top
D1  11.18,18.29 0 top
DIO0  19.3,33.78 0 top
DIO1  17.78,33.78 0 top
DIO2  16.26,33.78 0 top
DIO3  16.26,36.83 0 top
DIO4  16.26,35.31 0 top
DIO5  36.32,20.32 0 top
F1  12.95,22.1 270 top
GND  10.41,66.29 0 top
GND@1  67.82,29.21 0 top
IC1  49.02,27.94 90 top
IC2  61.21,37.08 180 top
IC3  26.16,65.02 0 top
ISP6  32.77,11.94 270 top
LED1  22.1,10.92 0 top
LED-ALT  14.48,57.15 0 top
PA1  44.7,63.5 0 top
PGA-103+  47.75,48.01 180 top
PTT  67.82,30.99 0 top
PTT1  9.4,56.13 0 bottom
PTT2  67.82,30.99 270 bottom
PTT-HI  12.7,57.15 0 top
PTT-LO  10.92,57.15 180 top
PWR  20.57,10.92 180 top
R1  16.51,29.21 270 top
R2  14.22,29.21 270 top
R3  22.1,14.73 270 top
R4  4.32,12.95 270 top
R5  32,19.3 90 top
R6  34.04,19.3 90 top
R7  20.57,57.91 270 top
R8  3.05,24.38 270 top
R9  12.19,45.47 180 top
R10  12.7,42.67 180 top
R11  14.99,60.96 270 top
R12  12.7,60.96 270 top
R13  18.8,10.92 270 top
R14  42.67,36.83 0 top
R15  35.05,45.97 90 top
R16  59.94,43.43 90 top
R17  61.98,43.43 90 top
R18  10.41,60.96 270 top
RF1  31.11,31.5 90 top
RF_ANT  69.6,61.47 180 top
RXD1  64.26,30.99 0 top
SJ1  24.13,53.85 180 top
SJ2  24.13,51.56 180 top
SJ3  24.13,49.28 180 top
SJ4  24.13,46.99 180 top
SJ5  8.13,16.26 180 top
SW1  37.85,48.01 0 top
SW1A  56.13,40.39 0 top
SW1B  56.13,42.42 0 top
SW2  64.01,55.37 180 top
SW2A  67.06,39.12 0 top
SW2B  67.06,36.83 0 top
TP1  14.22,50.04 0 top
TP2  14.22,48.51 0 top
TP3  11.94,53.85 0 top
TP4  16.26,38.35 0 top
TP5  19.3,38.35 0 top
TP6  38.1,20.32 0 top
TP7  11.94,51.05 0 top
TP8  26.92,56.64 0 top
TP10  53.59,41.4 0 top
TP11  53.59,38.35 0 top
TP12  53.59,39.88 0 top
TP14  64.26,29.21 0 top
TP15  66.04,29.21 0 top
TP-4  51.31,38.35 0 top
TP-6  51.31,41.4 0 top
TP-8  49.02,38.35 0 top
TP-9  49.02,39.88 0 top
TP-10  49.02,41.4 0 top
TP-12  51.31,39.88 0 top
TVS1  63.75,62.74 90 top
TXD1  66.04,30.99 0 top
U$2  0,0 0 top
U$3  54.1,2.03 90 top
U$6  56.13,48.01 180 top
USB  4.57,34.8 0 top
VGG  25.15,56.64 0 top
VIN  7.11,54.1 180 top
VR1  7.11,49.28 180 top
VR2  5.84,21.84 180 top
VR3  7.11,10.41 180 top
Y1  58.67,26.8 270 top

### Tracks (layer width: path | path; a pad name or v marks a point on that pad's centre or on a via)
4  (via drill 0.25)
  Top 0.254: IC1.25 51.42,35.19 v51.31,35.31
  Bottom 0.152: v51.31,35.31 TP-4.TP
  other vias: 51.31,38.35
5_RF_DIO3  (via drill 0.25)
  Top 0.152: IC1.31 46.62,34.91 45.72,35.81 34.8,35.81 34.12,36.5 RF1.11 34.04,38.92 v34.04,38.1
  Bottom 0.152: v34.04,38.1 33.27,38.86 31.5,38.86 30.48,37.85 22.61,37.85 21.84,37.08 18.8,37.08 18.54,36.83 DIO3.TP
  other vias: 16.26,36.83
5V_VREG
  Top 0.508: C19.1 C18.1 9.86,20.54 VR2.5 6.79,16.19 SJ5.3
6  (via drill 0.25)
  Top 0.254: IC1.27 49.82,35.27 v49.78,35.31
  Bottom 0.152: v49.78,35.31 49.78,36.58 50.04,36.83 50.04,40.89 50.55,41.4 TP-6.TP
  other vias: 51.31,41.4
7_LED  (via drill 0.25)
  Top 0.152: v24.38,5.59 24.64,5.33 45.72,5.33 46.23,5.84 46.23,19.81 45.02,21.02 IC1.1 | LED1.A 22.64,9.91 v24.38,9.91
  Bottom 0.152: v24.38,5.59 v24.38,9.91
8  (via drill 0.25)
  Top 0.254: IC1.28 v49.02,36.07
  Bottom 0.152: v49.02,36.07 TP-8.TP
  other vias: 49.02,38.35
8_SD_CD
  Top 0.152: IC1.8 50.62,20.9 50.55,20.83 50.55,5.08 51.56,4.06 54.51,4.06 U$3.CD1
9  (via drill 0.25)
  Top 0.254: IC1.29 48.22,35.27 v48.26,35.31
  Bottom 0.152: v48.26,35.31 48.26,39.62 48.51,39.88 TP-9.TP
  other vias: 49.02,39.88
10  (via drill 0.25)
  Top 0.254: IC1.30 47.42,35.99 v47.5,36.07
  Bottom 0.152: v47.5,36.07 47.5,36.58 47.75,36.83 47.75,40.89 48.26,41.4 TP-10.TP
  other vias: 49.02,41.4
11_SD_CS
  Top 0.152: IC1.12 54.55,23.94 54.61,23.88 54.61,11.68 56.39,11.68 56.39,8.64 61.47,8.64 62.71,9.93 U$3.2
12  (via drill 0.25)
  Top 0.254: IC1.26 50.62,35.99 v50.55,36.07
  Bottom 0.152: TP-12.TP 50.8,39.88 50.55,39.62 v50.55,36.07
  other vias: 51.31,39.88
13_RF_DIO4  (via drill 0.25)
  Top 0.152: IC1.32 45.82,34.95 45.47,35.31 33.27,35.31 32.12,36.47 RF1.12 32,38.88 v32,38.1
  Bottom 0.152: DIO4.TP 16.26,35.56 16.51,35.81 18.29,35.81 19.05,36.58 22.1,36.58 22.86,37.34 28.93,37.34 28.98,37.39 31.29,37.39 v32,38.1
  other vias: 16.26,35.31
14_MISO  (via drill 0.25)
  Top 0.152: v36.07,13.21 v43.69,13.21 | IC1.11 53.02,21.15 52.83,20.83 v52.83,13.21 v52.83,8.38 | U$3.7 62.12,4.43 61.72,4.83 v56.39,4.83 | RF1.2 26.11,17.07 28.7,14.48 ISP6.1
  Bottom 0.152: v56.39,4.83 v52.83,8.38 | ISP6.1 32.77,13.21 v36.07,13.21 | v43.69,13.21 v52.83,13.21
15_SCK  (via drill 0.25)
  Top 0.152: U$3.5 62.77,6.63 61.72,5.59 52.07,5.59 51.31,6.35 v51.31,10.67 51.31,20.83 51.42,21.22 IC1.9 | v28.96,16.76 28.96,20.07 30.11,21.23 RF1.4
  Bottom 0.152: v28.96,16.76 28.96,13.21 30.23,11.94 ISP6.3 32.77,10.67 v51.31,10.67
16_MOSI  (via drill 0.25)
  Top 0.152: U$3.3 62.93,8.83 61.47,7.37 52.58,7.37 52.07,7.87 v52.07,11.94 52.07,20.83 52.22,21.18 IC1.10 | RF1.3 28.11,22.27 27.69,21.84 27.69,16.51 28.45,15.75 29.72,15.75 30.48,16.51 32,16.51 32.77,15.75 32.77,13.21 ISP6.4 v43.69,11.94
  Bottom 0.152: v43.69,11.94 v52.07,11.94
22_TXRX_PTT  (via drill 0.35)
  Top 0.152: 65.02,37.34 60.71,37.34 59.94,38.1 IC2.5 | 65.02,37.34 65.53,37.34 66.29,36.58 66.29,32 | IC2.1 65.02,37.34 | PTT2.TP 67.82,31.75 67.56,32 66.29,32 | IC1.22 56.32,31.94 56.39,32 66.29,32
  other vias: 67.82,30.99
+3V3  (via drill 0.25, 0.35)
  Top 0.152: U$3.4 62.85,7.73 61.72,6.6 v52.58,6.6 | R6.1 ISP6.2 | v43.43,18.29 44.7,17.02 v44.7,6.6 | R10.2 11.43,43.18 11.43,45.21 11.18,45.45 R9.2 11.19,46.5 11.94,47.24 14.22,47.24 | 14.22,47.24 18.29,47.24 19.05,48.01 20.51,48.01 20.57,47.94 | SJ2.2 20.61,51.56 20.57,51.6 | 23.88,63.86 23.92,63.82 | C27.1 18.05,43.18 | TP5.TP 19.32,38.37 | C6.1 30.1,41.77 | 14.22,47.24 TP2.TP | v20.83,18.29 20.57,18.03 PWR.A | R18.1 10.4,61.96 10.41,62.23 10.41,63.25 11.43,64.26 v13.97,64.26
  Top 0.254: 44.7,25.54 IC1.42 41.15,25.54 41.15,23.94 | 44.7,23.94 IC1.44 41.15,23.94 | 44.7,25.54 44.7,23.94 | 44.7,31.94 44.7,25.54 | 44.7,31.94 IC1.34 43.67,32 43.67,33.04 43.43,33.27 | 45.78,23.94 44.7,23.94 | 45.78,23.94 49.02,23.94 | 49.02,23.94 IC1.6 49.02,19.81 48.77,19.56 C1.1 | 49.02,23.94 52.58,23.94 52.83,24.13 52.83,24.89 53.48,25.54 IC1.14 56.25,25.54 56.9,24.89 C30.1 60.18,24.11 v60.2,24.13 | 41.15,23.94 C5.1 | v45.72,24.89 45.72,24 45.78,23.94 | 19.3,56.76 20.57,56.76 20.57,51.6 20.57,47.94 20.57,43.18 | 20.57,43.18 20.57,42.16 20.83,42.42 | R7.1 18.93,56.76 19.3,56.76 | ADC1.8 C27.1 | IC3.4 24.03,63.92 23.92,63.82 C28.1 23.88,64.28 23.88,65.53 23.62,65.79 20.32,65.79 19.3,64.77 v19.3,64.26 19.3,56.76 | C31.1 43.43,33.27 | 43.43,33.27 45,33.27 45.02,33.51 IC1.33 45.02,32 | 45.02,32 52.07,32 52.22,32.16 IC1.24 52.22,35.5 | 45.02,32 44.7,32 44.7,31.94 | 52.22,35.5 52.22,35.92 v52.07,36.07 | C29.1 52.28,35.56 52.22,35.5 | 18.05,43.18 20.57,43.18 | 19.32,38.37 20.83,38.37
  Top 1.016: v20.83,18.29 20.83,38.37 20.83,42.42 30.1,42.42 30.1,41.77 30.11,39.35 RF1.13 | R6.1 R5.1 30.5,18.3 v29.97,18.29 v43.43,18.29 | VR3.5 8.11,9.16 C3.1 C4.1 v14.24,9.16
  Bottom 0.152: v52.58,6.6 v44.7,6.6 | v13.97,64.26 v19.3,64.26
  Bottom 0.254: v52.07,36.07 52.07,36.58 TP11.TP | v60.2,24.13 62.48,24.13 62.48,27.43 TP14.TP
  Bottom 1.016: v14.24,9.16 14.22,11.68 v20.83,18.29 v29.97,18.29 | v43.43,18.29 43.43,22.61 v45.72,24.89
  other vias: 53.59,38.35 64.26,29.21
+5V  (via drill 0.25)  (1 unrouted)
  Top 0.152: SW2.4 63.03,56.6 63.25,56.39 63.75,56.39 64.52,55.63 67.06,55.63 v67.06,52.32 | 44.43,41.91 BT1.3 C20.1 C21.1 47.75,40.13 47.75,43.18 48.26,43.69 55.12,43.69 | IC2.14 65.02,35.81 61.72,35.81 v60.96,36.58 | 55.12,41.41 v55.12,38.86 | 55.12,41.41 55.12,43.69 | TP10.TP 55.1,41.4 55.12,41.41 | 55.12,43.69 v58.17,43.69
  Top 0.254: SW2.4 61.47,57.42 C13.1
  Top 0.508: v60.71,10.67 60.71,21.34 62.48,23.11 v62.48,28.96 | 8.13,13.99 SJ5.2 8.13,18.29 D1.C | VR3.1 8.06,13.89 8.13,13.95
  Top 1.016: 4.3,13.97 2.79,13.97 2.29,13.46 v2.29,9.14 | 8.13,13.99 C2.1 8.13,13.95 R4.1
  Bottom 0.152: v58.17,43.69 59.69,43.69 67.06,51.05 v67.06,52.32
  Bottom 0.254: v60.96,36.58 57.4,36.58 v55.12,38.86 | v62.48,28.96 63.5,29.97 65.79,29.97 66.04,29.72 TP15.TP
  Bottom 0.508: v60.96,36.58 60.96,30.48 v62.48,28.96
  Bottom 1.016: v60.71,10.67 60.71,3.81 59.18,2.29 18.8,2.29 13.97,7.11 8.64,7.11 6.6,9.14 v2.29,9.14
  other vias: 66.04,29.21
+12V  (via drill 0.25)
  Top 0.152: C25.1 48.38,55.37 PA1.P$3 | C24.1 48.26,53.34 48.51,53.59 48.51,55.51
  Top 0.254: R8.1 4.6,25.38
  Top 0.508: 48.51,57.4 48.51,55.51 PA1.P$3 | VR2.1 6.79,25.32 C17.1
  Top 1.016: C17.1 4.6,25.38 | R8.1 4.56,25.4 2.29,25.4 2.29,53.94 2.42,54.08 | C8.1 2.38,58.42 2.29,58.33 | C9.1 2.37,56.39 2.29,56.47
  Top 1.27: v32.51,58.67 26.92,58.67 23.62,61.98 v20.83,61.98 | v46.23,57.4 48.51,57.4 | v7.87,61.98 4.83,61.98 2.29,59.44 2.29,58.33 2.29,56.47 2.29,53.94 | VR1.2 2.42,54.08
  Bottom 1.27: v32.51,58.67 46.23,58.67 v46.23,57.4 | v20.83,61.98 v7.87,61.98
A0_RF_DIO0  (via drill 0.25)
  Top 0.152: IC1.36 41.77,30.34 40.89,29.46 36.07,29.46 34.8,28.19 24.64,28.19 24.38,28.45 24.38,35.05 v24.64,35.31 25.65,36.32 25.91,36.32 26.42,36.83 27.94,36.83 28.11,37.01 RF1.14
  Bottom 0.152: v24.64,35.31 24.38,35.05 19.81,35.05 19.3,34.54 DIO0.TP
  other vias: 19.3,33.78
A1_RF_DIO1  (via drill 0.25)
  Top 0.152: IC1.37 41.73,29.54 41.15,28.96 36.32,28.96 35.05,27.69 24.13,27.69 23.88,27.94 23.88,35.81 v24.64,36.58 24.89,36.83 25.65,36.83 26.11,37.29 RF1.15
  Bottom 0.152: v24.64,36.58 23.88,35.81 22.86,35.81 22.61,35.56 19.56,35.56 18.8,34.8 18.03,34.8 17.78,34.54 DIO1.TP
  other vias: 17.78,33.78
A2_RF_DIO2  (via drill 0.25)
  Top 0.152: RF1.16 24.11,37.32 v23.37,36.58 23.37,27.43 23.62,27.18 35.31,27.18 36.58,28.45 41.4,28.45 41.69,28.74 IC1.38
  Bottom 0.152: v23.37,36.58 22.86,36.58 22.35,36.07 19.3,36.07 18.54,35.31 17.53,35.31 17.02,34.8 16.51,34.8 16.26,34.54 DIO2.TP
  other vias: 16.26,33.78
A3_RF_CS
  Top 0.152: R5.2 32.12,20.41 RF1.5 32.12,25.77 33.02,26.67 35.56,26.67 36.83,27.94 IC1.39
A4_RF_RST
  Top 0.152: R6.2 34.12,20.38 RF1.6 34.12,25.73 34.54,26.16 35.81,26.16 37.08,27.43 41.4,27.43 41.69,27.14 IC1.40
A5_RF_DIO5
  Top 0.152: IC1.41 41.73,26.34 41.15,26.92 37.34,26.92 36.12,25.7 RF1.7 36.07,23.95 36.07,20.57 DIO5.TP
ADDR  (via drill 0.25)
  Top 0.152: ADC1.1 19.79,49.29 v19.81,49.28 | SJ1.1 SJ2.1 24.89,50.55 | 24.89,50.55 SJ3.1 SJ4.1 | v26.42,49.28 SJ3.1 24.89,50.55
  Bottom 0.152: v19.81,49.28 v26.42,49.28
AIN1
  Top 0.152: ADC1.5 17.03,48.28 17.02,48.26 15.75,48.26 AIN1.TP
AIN2
  Top 0.152: AIN2.TP 16,45.21 16.02,45.19 ADC1.6
AIN3
  Top 0.152: ADC1.7 17.53,44.45 17.27,44.2 16.76,44.2 16.26,43.69 AIN3.TP
ALERT  (via drill 0.25)
  Top 0.152: ADC1.2 18.53,50.03 19.05,50.55 19.05,52.58 v18.54,53.09 | LED-ALT.A 14.48,56.13 15.49,56.13 15.49,55.37 16.76,54.1 v16.76,53.09
  Bottom 0.152: v16.76,53.09 v18.54,53.09
ANT
  Top 1.016: RF1.9 C14.2
D+
  Top 0.152: IC1.4 47.42,21.01 47.24,20.83 47.24,2.79 46.74,2.29 18.03,2.29 16.26,4.06 16.26,24.38 15.24,25.4 15.24,26.16 16.51,27.43 R1.2
D-  (via drill 0.25)
  Top 0.152: IC1.3 46.62,20.94 46.74,20.83 46.74,3.3 46.23,2.79 18.29,2.79 16.76,4.32 16.76,24.64 16,25.4 v16,25.91 | R2.2 v14.22,25.91
  Bottom 0.152: v16,25.91 v14.22,25.91
EN
  Top 0.508: 6.16,11.89 VR3.3 4.56,11.71 R4.2
GND  (via drill 0.25, 0.4)
  other vias: 37.59,21.84 7.11,56.9 7.11,58.93 7.11,57.91 7.11,55.88 15.75,52.58 15.75,51.56 5.84,24.13 10.16,25.91 10.16,24.89 11.18,23.88 10.16,23.88 9.14,23.88 8.13,23.88 11.43,13.46 11.43,14.48 12.45,12.45 11.43,12.45 10.41,12.45 9.4,12.45 38.61,21.84 48.26,20.83 49.02,16.26 41.91,31.11 53.85,34.29 53.85,33.27 48.01,16.26 41.91,24.77 57.15,26.8 60.2,27.3 60.2,26.29 19.56,54.36 17.27,60.45 63.5,5.59 66.8,5.59 67.06,1.02 68.33,1.02 69.09,17.02 67.82,17.02 37.59,26.16 38.61,26.16 30.99,21.59 28.96,21.59 24.64,26.16 23.62,26.16 35.56,36.83 36.58,36.83 35.56,41.4 34.54,41.4 39.37,25.65 39.37,24.64 39.37,23.62 39.37,22.61 37.59,36.83 38.61,36.83 39.62,36.83 39.62,37.85 39.62,38.86 39.62,39.88 39.62,40.89 39.62,41.91 39.62,42.93 39.62,43.94 39.62,44.96 36.58,41.4 36.58,42.42 36.58,43.43 35.56,43.43 24.64,41.15 26.67,41.15 23.62,41.15 19.56,39.88 25.65,41.15 27.94,6.1 21.84,17.02 40.64,19.56 41.66,19.56 61.21,46.99 47.75,44.7 46.74,44.7 48.77,44.7 49.53,45.21 49.53,46.23 50.55,46.48 44.7,63.5 44.7,60.45 44.7,66.55 47.75,66.55 47.75,63.5 47.75,60.45 50.8,60.45 50.8,63.5 50.8,66.55 53.85,66.55 53.85,63.5 53.85,60.45 41.66,66.55 41.66,63.5 41.66,60.45 38.61,60.45 38.61,63.5 38.61,66.55 35.56,66.55 35.56,63.5 35.56,60.45 32.51,60.45 29.46,60.45 29.46,66.55 32.51,66.55 56.9,66.55 59.94,66.55 56.9,60.45 59.94,60.45 46.74,51.56 47.75,51.56 48.77,51.56 49.78,51.56 50.8,51.56 51.82,51.56 52.83,51.56 53.85,51.56 50.8,52.58 50.8,53.59 50.8,54.61 50.8,55.63 50.8,56.64 50.8,57.66 45.72,51.56 44.7,51.56 43.69,51.56 42.67,51.56 41.66,51.56 40.64,51.56 39.62,51.56 38.61,51.56 37.59,51.56 36.58,51.56 38.61,52.58 38.61,53.59 38.61,54.61 38.61,55.63 38.61,56.64 44.45,52.58 44.45,53.59 57.91,51.56 59.94,51.82 60.96,51.82 61.98,51.82 62.99,51.82 63.75,52.32 55.88,57.91 56.9,54.86 55.88,56.9 55.88,55.88 55.88,54.86 57.91,54.86 58.93,54.61 59.94,54.61 60.96,54.61 61.98,54.61 65.02,54.61 64.01,54.61 62.99,54.61 33.27,55.63 33.27,54.61 33.27,53.59 33.27,52.58 33.27,51.56 33.27,50.55 33.27,49.53 33.27,48.51 34.29,48.51 35.31,48.51 36.32,48.51 37.34,48.51 38.35,48.51 39.37,48.51 40.39,48.51 41.4,48.51 42.42,48.51 43.43,48.51 45.97,46.23 58.67,45.47 44.96,48.51 33.27,56.64 40.64,56.64 39.62,56.64 45.97,45.21 44.96,47.5 44.96,46.48 51.56,46.48 58.17,57.91 53.59,46.48 52.58,46.48 54.86,51.56 55.88,51.56 54.61,45.47 56.9,51.56 55.63,45.47 58.93,51.82 53.59,45.47 56.64,45.47 67.82,29.21 63.5,49.02 64.26,49.78 62.48,49.02 65.79,51.31 66.04,52.32 66.04,53.34 66.04,54.36 57.66,45.47 58.67,46.23 61.47,49.02 45.97,43.43 59.18,46.99 60.2,46.99 42.93,38.61 61.47,48.01 41.91,38.61 58.17,56.9 58.93,58.93 59.94,58.93 59.94,55.88 58.93,55.88 65.02,50.55 46.99,43.43 69.09,38.1 69.09,41.15 57.4,38.35 5.84,46.74 5.84,48.01 5.84,49.28 5.84,45.47 5.84,44.2 7.11,46.74 8.38,46.74 7.11,48.01 7.11,49.28 8.38,49.28 8.38,48.01 8.38,45.47 7.11,45.47 7.11,44.2 8.38,44.2 4.57,44.2 4.57,45.47 4.57,46.74 4.57,48.01 4.57,49.28 9.65,49.28 9.65,48.01 9.65,46.74 9.65,45.47 9.65,44.2 20.57,64.77 20.57,63.75 25.91,67.31 18.29,50.8 18.03,48.01 18.29,60.45 18.29,51.82 21.59,54.36 21.59,53.34 60.96,58.93 61.98,58.93 62.23,59.94 62.23,60.96 62.23,61.98 62.23,62.99 62.23,64.01 64.26,64.01 63.25,64.01 68.83,58.93 67.56,58.93 68.83,64.01 67.56,64.01 66.29,58.93 65.28,59.94 65.28,58.93 65.28,64.01 66.29,64.01 26.92,67.31 26.92,61.21 27.94,66.55 27.94,65.02 27.94,63.5 27.94,61.98 27.94,60.45 26.92,62.74 27.94,68.07 25.4,29.21 25.4,30.48 25.4,31.75 25.4,33.02 25.4,34.29 26.67,35.56 27.94,35.56 29.21,35.56 30.48,35.56 31.75,35.56 26.67,29.21 27.94,29.21 29.21,29.21 30.48,29.21 31.75,29.21 33.02,29.21 34.29,29.21 26.67,30.48 27.94,30.48 29.21,30.48 30.48,30.48 31.75,30.48 33.02,30.48 34.29,30.48 26.67,31.75 26.67,33.02 26.67,34.29 27.94,34.29 29.21,34.29 30.48,34.29 31.75,34.29 29.21,36.83 30.48,36.83 27.94,33.02 29.21,33.02 30.48,33.02 31.75,33.02 31.75,31.75 30.48,31.75 29.21,31.75 27.94,31.75 33.02,34.29 34.29,34.29 35.56,34.29 36.83,34.29 38.1,34.29 39.37,34.29 33.02,33.02 33.02,31.75 34.29,31.75 34.29,33.02 35.56,33.02 36.83,33.02 35.56,31.75 35.56,30.48 36.83,30.48 36.83,31.75 38.1,33.02 38.1,31.75 38.1,30.48 39.37,30.48 39.37,31.75 39.37,33.02 56.39,20.83 57.4,20.83 33.27,47.5 33.27,46.48 33.27,45.47 66.04,57.66 25.65,26.16 26.67,26.16 27.69,26.16 28.7,26.16 29.72,26.16 30.73,26.16 22.61,41.15 28.7,41.15 27.69,41.15 22.1,33.78 22.1,32.77 22.1,31.75 22.1,30.73 22.1,29.72 22.1,28.7 22.1,27.69 22.1,26.67 22.1,25.65 22.1,24.64 22.1,23.62 22.1,21.59 26.92,21.59 23.11,21.59 24.13,21.59 57.4,41.91 48.77,27.94 48.77,30.99 48.77,24.89 48.77,29.46 48.77,26.42 47.24,30.99 45.72,30.99 45.72,29.46 47.24,29.46 47.24,27.94 45.72,27.94 45.72,26.42 47.24,26.42 47.24,24.89 50.29,30.99 50.29,29.46 50.29,27.94 50.29,26.42 50.29,24.89 51.82,24.89 51.82,26.42 51.82,27.94 51.82,29.46 51.82,30.99 53.34,30.99 53.34,29.46 53.34,27.94 53.34,26.42 27.94,12.7 20.57,8.38 53.59,39.88 22.1,40.39 16.26,38.35 17.53,39.88 18.54,39.88 38.1,20.32 33.02,21.59 35.05,21.59 25.15,21.59 22.1,22.61 22.1,39.37 22.1,38.35 0.76,22.86 0.76,48.26 0.76,27.94 0.76,33.02 0.76,38.1 0.76,43.18 12.7,69.09 0.76,53.34 0.76,58.42 8.13,0.76 12.7,0.76 17.78,0.76 22.86,0.76 27.94,0.76 33.02,0.76 38.1,0.76 43.18,0.76 48.26,0.76 53.34,0.76 58.42,0.76 63.5,0.76 0.76,12.7 0.76,17.78 17.78,69.09 22.86,69.09 27.94,69.09 33.02,69.09 38.1,69.09 43.18,69.09 48.26,69.09 53.34,69.09 58.42,69.09 63.5,69.09 68.58,69.09 69.09,7.62 69.09,12.7 69.09,28.7 69.09,20.57 69.09,33.02 66.29,41.15 69.09,49.28 69.09,53.34 69.09,65.53 69.09,57.66 19.81,51.31 7.62,38.1 6.86,33.02 8.13,5.08 12.7,5.08 25.65,6.1 38.1,7.62 43.18,7.62 33.02,7.62 22.1,8.38 38.1,16.51 43.18,16.51 30.23,7.62 63.5,17.78 63.5,12.7 62.99,22.1 17.78,63.5 7.11,59.94 20.32,58.42 19.05,13.21 19.05,23.11 14.73,23.11 14.73,18.8 58.42,17.78 58.42,12.7 55.63,17.78 55.63,12.7 19.05,18.8 48.51,8.64 48.51,5.33 48.51,14.73 44.45,54.61 44.45,55.63 44.45,56.64 40.64,31.75 40.64,30.48 21.59,52.32 7.11,12.7 5.84,21.84 7.11,10.41 10.92,18.29 15.24,63.5 55.37,34.04 55.37,33.02 32.26,56.64 31.24,56.64 30.23,56.64 14.22,50.04 11.3,50.42 12.57,51.69 12.57,50.42 11.3,51.69 29.21,56.64 28.19,56.64 26.92,56.64 63.5,27.43 0.76,62.48 8.13,69.09 8.13,63.5 0.76,7.62 5.84,7.62 19.05,4.57 30.48,6.1 25.65,7.62 43.18,4.57 38.1,4.57 33.02,4.57 27.94,4.57 22.86,4.57 27.94,7.62 25.15,17.02 25.15,12.7 33.27,44.45 33.53,43.43 34.54,43.43 63.5,36.58 59.69,35.81 12.7,63.5 62.99,55.63 61.98,55.63 21.59,55.37 66.55,49.28 65.02,20.57 5.84,17.78
  pour Bottom (rank 6, no thermals): 69.6,0.25 7.87,0.25 7.87,7.11 0.25,7.11 0.25,62.74 7.87,62.74 7.87,69.6 69.6,69.6 69.6,49.02 65.02,49.02 62.48,46.48 62.48,43.94 65.02,41.4 69.6,41.4 69.6,28.45 64.77,28.45 62.48,26.16 62.48,23.11 64.77,20.83 69.6,20.83
  pour Top (rank 6, no thermals): 69.6,0.25 7.87,0.25 7.87,7.11 0.25,7.11 0.25,62.74 7.87,62.74 7.87,69.6 69.6,69.6 69.6,49.02 65.02,49.02 62.48,46.48 62.48,43.94 65.02,41.4 69.6,41.4 69.6,28.45 64.77,28.45 62.48,26.16 62.48,23.11 64.77,20.83 69.6,20.83
N$1
  Top 0.152: USB.D+ 8.57,37.02 9.14,37.59 12.7,37.59 13.97,36.32 13.97,32.26 14.73,31.5 16.51,31.5 R1.1
N$2
  Top 0.152: LED1.C R3.2
N$3
  Top 0.152: USB.D- 13.2,36.05 13.46,35.79 13.46,32.01 14.22,31.24 R2.1
N$4
  Top 0.152: C15.2 35.05,54.75 PA1.P$1
N$5  (via drill 0.35)  (1 unrouted)
  Top 0.152: PTT1.TP 11.4,56.13 PTT-HI.A
  other vias: 9.4,56.13
N$6
  Top 0.152: C10.1 55.64,53.46 PA1.P$4
N$7
  Top 1.016: 57.66,53.32 C10.2 62.54,53.34
  pour Top (no thermals): 58.17,53.85 63.25,53.85 63.25,52.83 58.17,52.83
N$8
  Top 0.152: PTT-HI.C R12.2
N$9
  Top 0.152: R13.2 20.78,9.92 PWR.C
N$10
  Top 0.508: C26.1 55.3,48.02 U$6.5
  pour Top (no thermals): 52.58,48.51 54.1,48.51 54.36,48.26 54.86,48.26 54.86,47.75 54.36,47.75 54.1,47.5 52.58,47.5
N$11
  Top 0.152: TVS1.P$1 C11.2
  Top 0.254: 68.82,61.45 RF_ANT.P
  Top 1.27: C11.2 68.82,61.45
N$12
  Top 0.254: SW2.3 63.68,59.38 C11.1
  pour Top (no thermals): 63.5,57.66 63.5,58.17 63.25,58.42 62.99,58.42 62.99,59.18 64.52,59.18 64.52,58.42 64.14,58.42 63.88,58.17 63.88,57.66
N$13
  Top 0.254: 38.17,44 C14.1
  Top 0.406: SW1.3 38.17,44
N$14
  Top 0.254: C15.1 35.34,50.05
  Top 0.406: 35.34,50.05 SW1.8
  pour Top (no thermals): 37.08,50.55 35.56,50.55 35.56,49.53 37.08,49.53
N$15
  Top 0.254: 41.65,50.06 C16.2
  Top 0.406: SW1.5 41.65,50.06
  pour Top (no thermals): 38.61,50.55 41.15,50.55 41.15,49.53 38.61,49.53
N$16
  Top 0.152: R14.1 40.64,36.83 40.39,37.08 40.39,45.97 39.37,46.99 37.85,46.99 37.52,46.66 SW1.2
N$17
  Top 0.152: BT1.1 41.91,46.48 44.2,46.48 44.2,50.01 44.16,50.04
  Top 0.508: 44.16,50.04 C16.1 | 46.2,50.04 PGA-103+.3
  Top 1.016: 44.16,50.04 46.2,50.04
N$18  (via drill 0.25)
  Top 0.152: R7.2 24.89,57.91 v25.15,57.66 VGG.TP | v42.16,57.4 42.42,57.15 42.42,55.39 C23.1 43.28,55.37 | 43.28,55.37 PA1.P$2 | C22.1 43.43,53.34 43.43,55.21 43.28,55.37
  Bottom 0.152: v25.15,57.66 41.91,57.66 v42.16,57.4
N$19
  Top 0.508: C12.1 62.99,50.29 64.98,52.28 SW2.8
  pour Top (no thermals): 62.99,50.8 60.2,50.8 60.2,49.78 63.25,49.78 65.28,51.82 65.28,53.85 64.77,53.85 64.77,52.58
N$20
  Top 0.508: U$6.2 60.18,48.01 C12.2
  pour Top (no thermals): 57.4,48.26 57.4,47.75 59.18,47.75 59.18,48.77 58.17,48.77 57.91,48.26
N$21
  Top 0.152: SW1.1 36.87,45.25 36.58,44.96 35.07,44.96 R15.1
N$22
  Top 0.152: 49.3,50.04 PGA-103+.1
  Top 0.813: C26.2 52.07,50.04
  Top 1.016: 52.07,50.04 49.3,50.04
N$23
  Top 0.508: VR2.3 3.32,23.14 R8.2
N$24
  Top 0.152: LED-ALT.C 14.48,59.94 R11.2
N$25
  Top 0.152: SW2.1 64.98,56.68 65.02,56.64 67.82,56.64 68.33,56.13 68.33,51.05 67.31,51.05 61.72,45.47 61.72,44.45 R17.2
N$26
  Top 0.152: SW2.2 64.33,56.57 64.77,56.13 67.56,56.13 67.82,55.88 67.82,51.56 67.06,51.56 60.71,45.21 60.71,44.45 R16.2
N$27
  Top 0.152: PTT-LO.A 10.92,59.96 R18.2
RST  (via drill 0.25)
  Top 0.152: v53.85,19.3 53.85,23.11 53.34,23.62 53.34,24.64 53.44,24.74 IC1.13 | v45.47,19.3 45.47,6.1 45.21,5.84 31.5,5.84 31.5,6.86 | 31.5,6.86 ISP6.5 | BTN1.3 23.37,6.86 31.5,6.86
  Top 0.254: BTN1.1 BTN1.3
  Bottom 0.152: v53.85,19.3 v45.47,19.3
RXD1
  Top 0.152: IC1.20 56.25,30.34 56.39,30.48 62.99,30.48 63.5,30.99 RXD1.TP
SCL  (via drill 0.25)
  Top 0.152: IC1.18 56.93,28.74 57.4,29.21 59.94,29.21 61.21,27.94 61.21,23.62 59.44,21.84 59.44,11.18 v58.93,10.67 | v12.95,40.64 12.95,38.1 14.48,36.58 14.48,32.51 14.99,32 17.53,32 18.03,31.5 18.03,27.43 17.27,26.67 17.27,4.57 18.54,3.3 45.47,3.3 v45.72,3.56 | ADC1.10 19.05,45.21 v19.05,46.74 13.46,46.74 13.21,46.48 13.21,45.48 | 13.21,45.48 R9.1 | v22.35,46.74 22.61,46.99 SJ4.2 | v13.21,44.2 13.21,45.48
  Bottom 0.152: v45.72,3.56 58.93,3.56 v58.93,10.67 | v22.35,46.74 v19.05,46.74 | v13.21,44.2 12.95,43.94 v12.95,40.64
SDA  (via drill 0.25)
  Top 0.152: IC1.19 56.97,29.54 57.15,29.72 60.2,29.72 61.72,28.19 61.72,23.37 59.94,21.59 59.94,9.91 59.69,9.65 v57.91,9.65 | v44.7,4.32 44.2,3.81 18.8,3.81 17.78,4.83 17.78,26.42 18.54,27.18 18.54,31.75 17.78,32.51 15.24,32.51 14.99,32.77 14.99,36.83 13.72,38.1 13.72,43.16 R10.1 13.72,43.2 13.72,43.94 14.22,44.45 14.22,45.72 14.73,46.23 18.29,46.23 18.54,45.97 18.54,45.2 ADC1.9 18.53,44.46 18.8,44.2 v19.81,44.2 | v21.84,45.21 21.59,45.47 21.59,49.02 21.84,49.28 SJ3.2
  Bottom 0.152: v44.7,4.32 55.63,4.32 55.88,4.06 57.91,4.06 v57.91,9.65 | v19.81,44.2 19.81,45.21 v21.84,45.21
SW1A  (via drill 0.25)
  Top 0.152: v41.15,39.62 40.89,39.88 40.89,46.23 39.62,47.5 36.58,47.5 36.07,46.99 35.07,46.99 R15.2 | v46.23,37.59 46.48,37.34 56.13,37.34 | 56.13,37.34 56.9,37.34 57.4,36.83 IC2.8 57.4,33.53 | SW1A.TP 56.13,37.34
  Bottom 0.152: v41.15,39.62 40.89,39.37 40.89,37.59 41.15,37.34 45.97,37.34 v46.23,37.59
SW1B  (via drill 0.25)
  Top 0.152: IC2.6 v58.67,38.35 IC2.9 58.67,32.51 56.64,32.51 56.39,32.77 56.39,36.5 56.06,36.83 R14.2
  Bottom 0.152: v58.67,38.35 58.67,39.62 57.91,40.39 56.64,40.39 56.13,40.89 SW1B.TP
  other vias: 56.13,42.42
SW2A  (via drill 0.25)
  Top 0.152: R17.1 62.48,42.43 IC2.3 62.48,38.61 62.74,38.35 v63.75,38.35 IC2.2
  Bottom 0.152: v63.75,38.35 66.29,38.35 SW2A.TP
  other vias: 67.06,39.12
SW2B  (via drill 0.25)
  Top 0.152: R16.1 60.45,42.42 60.45,41.66 61.21,41.66 IC2.4 v61.21,38.35
  Bottom 0.152: v61.21,38.35 61.98,37.59 66.29,37.59 SW2B.TP
  other vias: 67.06,36.83
TXD1  (via drill 0.25)
  Top 0.152: IC1.21 56.29,31.14 56.39,31.24 v62.48,31.24
  Bottom 0.152: v62.48,31.24 65.79,31.24 TXD1.TP
  other vias: 66.04,30.99
V_PA_TEMP
  Top 0.152: AIN0.TP 16,50.29 17.52,50.29 17.53,50.31
  Top 0.254: ADC1.4 17.53,50.31 17.53,54.35 16.26,55.63 16.26,65.79 17.53,67.06 25.15,67.06 25.51,66.69 IC3.3
VBUS
  Top 0.152: IC1.7 49.82,21.04 49.78,20.83 49.78,2.54 49.02,1.78 17.78,1.78 15.75,3.81 15.75,20.09 15.17,20.68 F1.2
  Top 0.508: SJ5.1 11.94,16.26 13.03,17.34 D1.A 12.95,18.36 F1.2
VIN
  Top 1.27: 9.37,54.1 VR1.1 11.71,54.08 | 11.71,54.08 TP3.TP 11.94,54.1 VIN.1 | C7.1 11.72,54.09 11.71,54.08
VUSB
  Top 0.508: USB.VBUS 10.67,33.43 10.67,28.19 12.95,25.91 F1.1
XTAL1
  Top 0.254: IC1.17 56.9,27.94 56.9,28 Y1.1
XTAL2
  Top 0.254: IC1.16 56.39,27.14 56.39,26.42 57.21,25.6 Y1.3

### Text on the board
tPlace: GND | GND | GND | +3V3 | uC TP | RFM | TP | MISO | +3V3 | SCK | MOSI | RST | GND | PN: | REV: | SN:
tNames: GND | +3V3 | SCL | SDA | ADS1115 ADDR | +5V | GND | GND | +3V3 | +3V3 | +3V3 | +5V | GND | GND | VREG | VBUS | RESET